# Altium schematic sheet DriveBoard.SchDoc
size A3
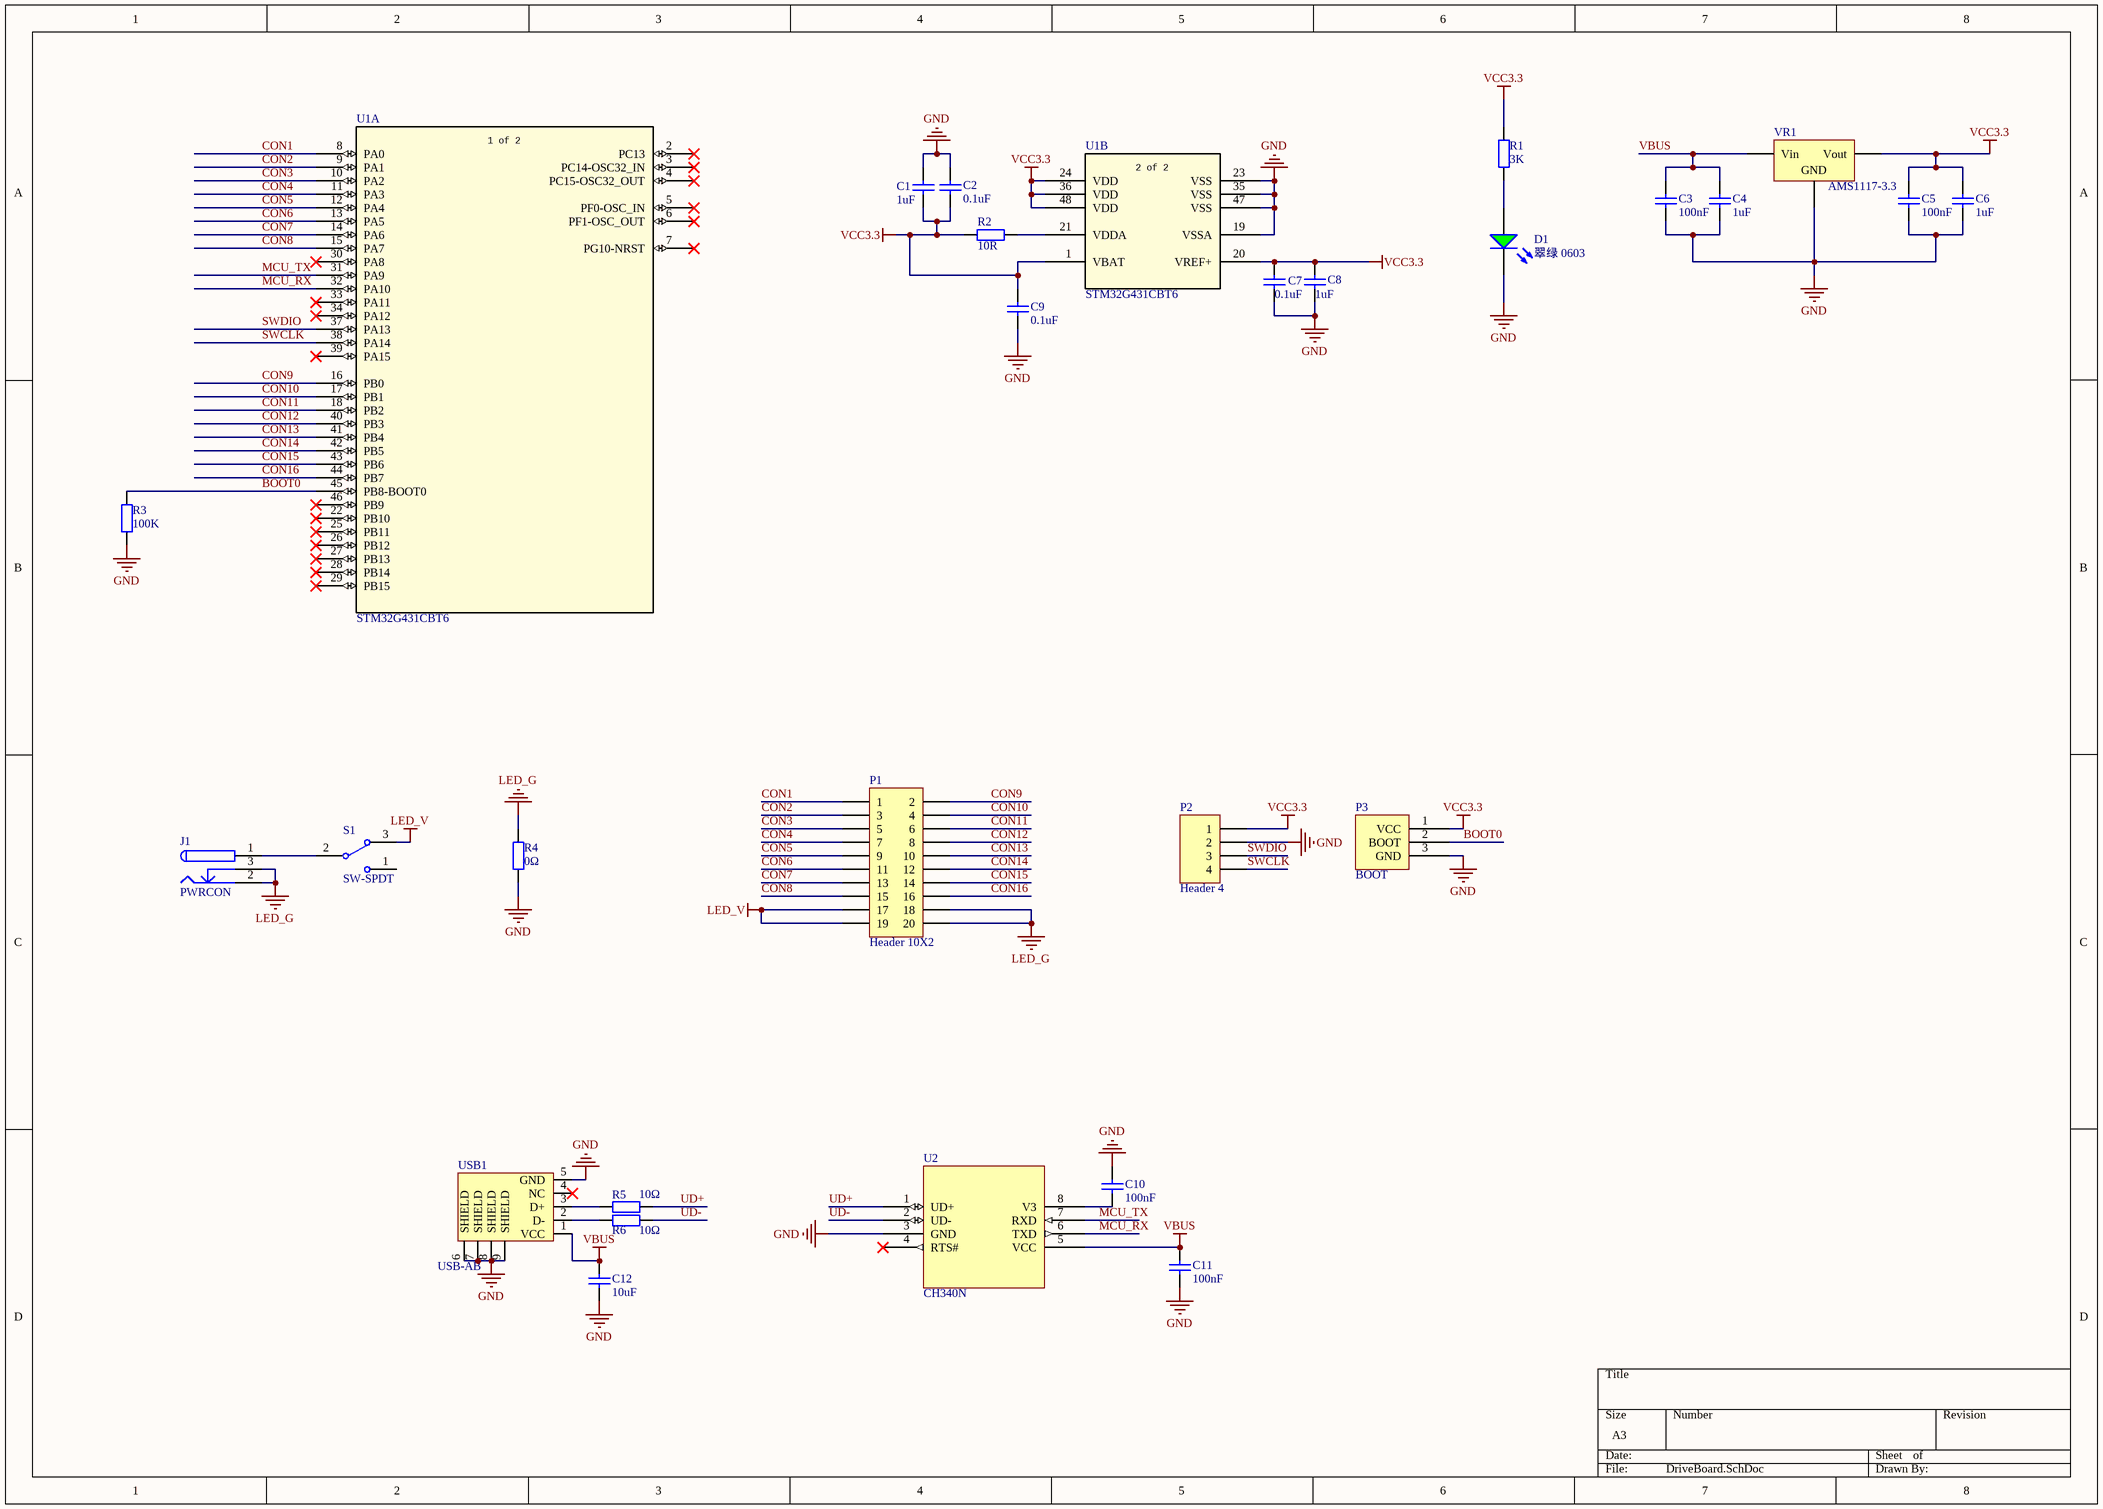
[diagram p0: DriveBoard.SchDoc]

## Parts
C1  1uF  [0603_C]
C2  0.1uF  [0603_C]
C3  100nF  [0603_C]
C4  1uF  [0603_C]
C5  100nF  [0603_C]
C6  1uF  [0603_C]
C7  0.1uF  [0603_C]
C8  1uF  [0603_C]
C9  0.1uF  [0603_C]
C10  100nF  [0603_C]
C11  100nF  [0603_C]
C12  10uF  [0603_C]
D1  翠绿 0603  [0603_LED_S1]
J1  PWRCON  [DC-005]
P1  Header 10X2  [HDR2.54-M-LS-2x10P]
P2  Header 4  [HDR1X4]
P3  BOOT  [BOOT]
R1  3K  [0603_R]
R2  10R  [0603_R]
R3  100K  [0603_R]
R4  0Ω  [LC-0603_R]
R5  10Ω  [0603_R]
R6  10Ω  [0603_R]
S1  SW-SPDT  [SWITCH_A1]
U1  STM32G431CBT6  [LQFP48-7x7mm]  (parts A,B of 2)
U2  CH340N  [SOP8]
USB1  USB-AB  [USB_AB - 5S - B]
VR1  AMS1117-3.3  [SOT-223]

## Nets
GND: C1.1 C2.1 C3.1 C4.1 C5.1 C6.1 C7.1 C8.1 C9.2 C10.2 C11.1 C12.1 D1.K P2.2 P3.3(GND) R3.2 R4.2 U1.19(VSSA) U1.23(VSS) U1.35(VSS) U1.47(VSS) U2.3(GND) USB1.5(GND) USB1.6(SHIELD) USB1.7(SHIELD) USB1.8(SHIELD) USB1.9(SHIELD) VR1.1(GND)
LED_G: J1.2 J1.3 P1.18 P1.20 R4.1
LED_V: P1.17 P1.19 S1.3
VBUS: C3.2 C4.2 C11.2 C12.2 U2.5(VCC) USB1.1(VCC) VR1.3(Vin)
VCC3.3: C1.2 C2.2 C5.2 C6.2 C7.2 C8.2 C9.1 P2.1 P3.1(VCC) R1.1 R2.2 U1.1(VBAT) U1.20(VREF+) U1.24(VDD) U1.36(VDD) U1.48(VDD) VR1.2(Vout)
BOOT0: P3.2(BOOT) R3.1 U1.45(PB8-BOOT0)
CON1: P1.1 U1.8(PA0)
CON2: P1.3 U1.9(PA1)
CON3: P1.5 U1.10(PA2)
CON4: P1.7 U1.11(PA3)
CON5: P1.9 U1.12(PA4)
CON6: P1.11 U1.13(PA5)
CON7: P1.13 U1.14(PA6)
CON8: P1.15 U1.15(PA7)
CON9: P1.2 U1.16(PB0)
CON10: P1.4 U1.17(PB1)
CON11: P1.6 U1.18(PB2)
CON12: P1.8 U1.40(PB3)
CON13: P1.10 U1.41(PB4)
CON14: P1.12 U1.42(PB5)
CON15: P1.14 U1.43(PB6)
CON16: P1.16 U1.44(PB7)
MCU_RX: U1.32(PA10) U2.6(TXD)
MCU_TX: U1.31(PA9) U2.7(RXD)
SWCLK: P2.4 U1.38(PA14)
SWDIO: P2.3 U1.37(PA13)
UD+: R5.2 U2.1(UD+)
UD-: R6.2 U2.2(UD-)
NetC10_1: C10.1 U2.8(V3)
NetD1_A: D1.A R1.2
NetJ1_1: J1.1 S1.2
NetR2_1: R2.1 U1.21(VDDA)
NetR5_1: R5.1 USB1.3(D+)
NetR6_1: R6.1 USB1.2(D-)

Not connected (* = marked no-connect by the designer): S1 1; U1 2(PC13)* 3(PC14-OSC32_IN)* 4(PC15-OSC32_OUT)* 5(PF0-OSC_IN)* 6(PF1-OSC_OUT)* 7(PG10-NRST)* 22(PB10)* 25(PB11)* 26(PB12)* 27(PB13)* 28(PB14)* 29(PB15)* 30(PA8)* 33(PA11)* 34(PA12)* 39(PA15)* 46(PB9)*; U2 4(RTS#)*; USB1 4(NC)*

## Notes on the sheet
- (in symbol STM32G431CBT6, part A) 1 of 2
- (in symbol STM32G431CBT6, part B) 2 of 2

## Library data of the parts
C1 C2 C7-C9 = 0805 1uF (105) 10% 50V: 贴片电容; ComponentLink1Description: 供应商链接; ComponentLink1URL: http://www.szlcsc.com/product/details_29074.html; Package: 0805; Supplier: LC; SuppliersPartNumber: C28323
C3 C5 C10-C12 = 0603 100nF (104) 10% 50V: 贴片电容; ComponentLink1Description: 供应商链接; ComponentLink1URL: http://www.szlcsc.com/product/details_15331.html; Package: 0603; Supplier: LC; SuppliersPartNumber: C14663
C4 C6 = 0603 1uF (105) 10% 50V: 贴片电容; ComponentLink1Description: 供应商链接; ComponentLink1URL: http://www.szlcsc.com/product/details_16531.html; Package: 0603; Supplier: LC; SuppliersPartNumber: C15849
D1 = 0805 翠绿: 发光二极管; ComponentLink1Description: 供应商链接; ComponentLink1URL: http://www.szlcsc.com/product/details_2670.html; Package: 0805; Supplier: LC; SuppliersPartNumber: C2297
J1 = PWRCON: 直流电源端子; Published: 17-Dec-2003; DatasheetDocument: 09-May-2002; Publisher: Altium Limited; ComponentLink1Description: Manufacturer Link; ComponentLink1URL: http://domino.kycon.com/internet/Products.html
P1 = Header 10X2: Header, 10-Pin, Dual row; LatestRevisionDate: 17-Jul-2002; LatestRevisionNote: Re-released for DXP Platform.; Publisher: Altium Limited
P2 = Header 4: Header, 4-Pin; LatestRevisionDate: 17-Jul-2002; LatestRevisionNote: Re-released for DXP Platform.; Publisher: Altium Limited
R1-R3 = 0805 9.1KΩ (9101) 1%: 贴片电阻; ComponentLink1Description: 供应商链接; ComponentLink1URL: http://www.szlcsc.com/product/details_18543.html; Package: 0805; Supplier: LC; SuppliersPartNumber: C17855
R4 = 0603 0Ω (0R0) 1%: 贴片电阻; ComponentLink1Description: 供应商链接; ComponentLink1URL: http://www.szlcsc.com/product/details_21903.html; Package: 0603; Supplier: LC; SuppliersPartNumber: C21189
R5 R6 = 0603 10Ω (10R0) 1%: 贴片电阻; ComponentLink1Description: 供应商链接; ComponentLink1URL: http://www.szlcsc.com/product/details_23586.html; Package: 0603; Supplier: LC; SuppliersPartNumber: C22859
S1 = SW-SPDT: 开关; Published: 24-Mar-1999; LatestRevisionDate: 17-Dec-2003; LatestRevisionNote: Schematic revised, PCB Footprint replaced.; DatasheetDocument: 05-Dec-2000; PackageReference: TL36WW15050; Publisher: Altium Limited; ComponentLink1Description: Manufacturer Link; ComponentLink1URL: http://www.apem.com
U1 = STM32G431CBT6: No Description Available; Vendor: STMicroelectronics; Built_By: EMA_UL_Team; SourceLibrary: Updates_to_database_2020-10-19; Manufacturer_Part_Number: STM32G431CBT6; Copyright: Copyright (C) 2018 Accelerated Designs. All rights reserved; RefDes: RefDes; Type: DEV
U2 = CH340N: USB to TTL Serial / UART
USB1 = USB-AB: MicroUSB
VR1 = SOT-223 AMS1117-3.3: 低压差线性稳压(LDO); ComponentLink1Description: 供应商链接; ComponentLink1URL: http://www.szlcsc.com/product/details_6652.html; Package: SOT-223; Supplier: LC; SuppliersPartNumber: C6186